# EAGLE design Transmitter V1 (EAGLE 9.6.0)
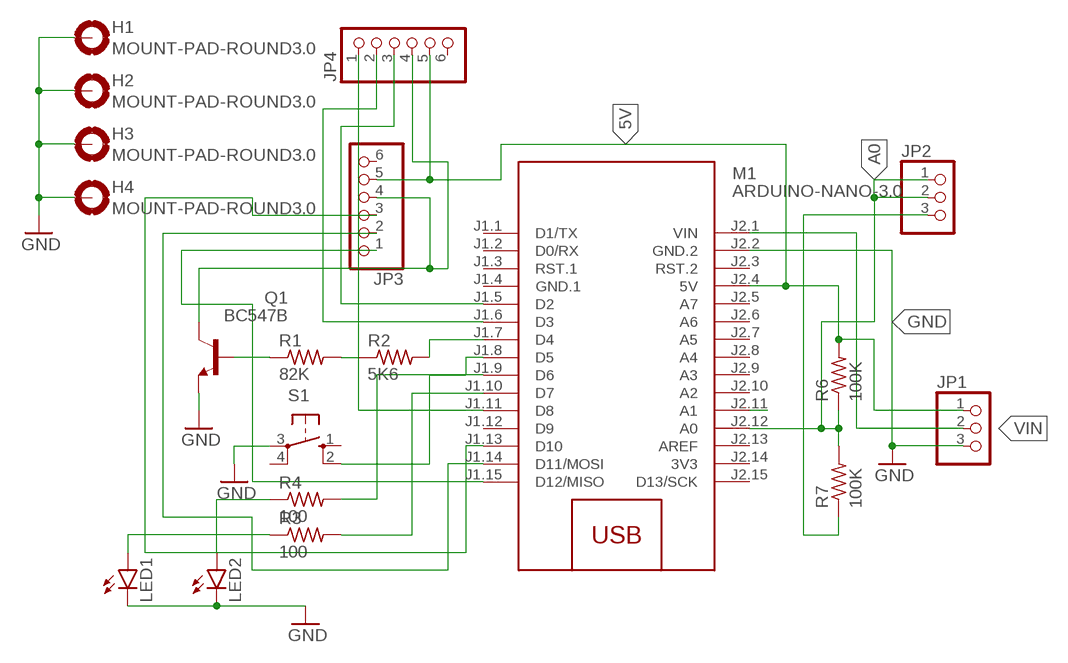
[diagram p0: schematic, sheet 1]

## Parts
H1  MOUNT-PAD-ROUND3.0  [3,0-PAD]
H2  MOUNT-PAD-ROUND3.0  [3,0-PAD]
H3  MOUNT-PAD-ROUND3.0  [3,0-PAD]
H4  MOUNT-PAD-ROUND3.0  [3,0-PAD]
JP1  PINHD-1X3  [1X03]
JP2  PINHD-1X3  [1X03]
JP3  PINHD-1X6  [1X06]
JP4  PINHD-1X6  [1X06]
LED1  LED3MM  [LED3MM]
LED2  LED3MM  [LED3MM]
M1  ARDUINO-NANO-3.0  [ARDUINO-NANO-3.0]
Q1  BC547B  [TO92]
R1  82K  R-US_0207/7  [0207/7]
R2  5K6  R-US_0207/7  [0207/7]
R3  100  R-US_0207/7  [0207/7]
R4  100  R-US_0207/7  [0207/7]
R6  100K  R-US_0207/7  [0207/7]
R7  100K  R-US_0207/7  [0207/7]
S1  10-XX  [B3F-10XX]

## Nets
5V: JP1.1 JP3.5 JP4.5 M1.J2.4(5V) R6.2
A0: JP2.1 JP2.2 M1.J2.12(A0) R6.1 R7.2
GND: H1.B3,0(MOUNT) H2.B3,0(MOUNT) H3.B3,0(MOUNT) H4.B3,0(MOUNT) JP1.3 LED1.K(C) LED2.K(C) M1.J2.2(GND.2) Q1.1(E) S1.3(P)
N$1: M1.J1.7(D4) R2.2
N$2: Q1.2(B) R1.1
N$3: R1.2 R2.1
N$4: JP3.4 JP4.4 Q1.3(C)
N$5: M1.J1.8(D5) S1.2(S1)
N$6: JP3.2 M1.J1.14(D11/MOSI)
N$7: LED2.A R4.1
N$8: LED1.A R3.1
N$9: M1.J1.10(D7) R3.2
N$10: M1.J1.9(D6) R4.2
N$11: JP4.2 M1.J1.6(D3)
N$12: JP2.3 R7.1
N$13: JP4.3 M1.J1.5(D2)
N$14: JP3.3 M1.J1.13(D10)
N$15: JP3.1 M1.J1.15(D12/MISO)
N$18: M1.J2.11(A1)
N$48: JP4.1 M1.J1.11(D8)
VIN: JP1.2 M1.J2.1(VIN)
Unconnected: JP3.6 JP4.6 M1.J1.1(D1/TX) M1.J1.2(D0/RX) M1.J1.3(RST.1) M1.J1.12(D9) M1.J2.3(RST.2) M1.J2.5(A7) M1.J2.6(A6) M1.J2.7(A5) M1.J2.8(A4) M1.J2.9(A3) M1.J2.10(A2) M1.J2.13(AREF) M1.J2.15(D13/SCK) S1.1(S) S1.4(P1)

## Power pins joined to a net without a drawn wire
3V3: M1.J2.14(3V3)
GND.1: M1.J1.4(GND.1)

## Library data of the parts
H1-H4 = holes:MOUNT-PAD-ROUND: MOUNTING PAD, round
JP1 JP2 = pinhead:PINHD-1X3: PIN HEADER
JP3 JP4 = pinhead:PINHD-1X6: PIN HEADER
LED1 LED2 = led:LED: LED OSRAM: - CHIPLED LG R971, LG N971, LY N971, LG Q971, LY Q971, LO R971, LY R971 LH N974, LH R974 LS Q976, LO Q976, LY Q976 LO Q996 - Hyper CHIPLED LW Q18S LB Q993, LB Q99A, LB R99A - SideLED LS A670, LO A670, LY A670, LG A670, LP A670 LB A673, LV A673, LT A673, LW A673 LH A674 LY A675 LS A676, LA A676, LO A676, LY A676, LW A676 LS A679, LY A679, LG A679 - Hyper Micro SIDELED® LS Y876, LA Y876, LO Y876, LY Y876 LT Y87S - SmartLED LW L88C, LW L88S LB L89C, LB L89S, LG L890 LS L89K, LO L89K, LY L89K LS L896, LA L896, LO L896, LY L896 - TOPLED LS T670, LO T670, LY T670, LG T670, LP T670 LSG T670, LSP T670, LSY T670, LOP T670, LYG T670 LG T671, LOG T671, LSG T671 LB T673, LV T673, LT T673, LW T673 LH T674 LS T676, LA T676, LO T676, LY T676, LB T676, LH T676, LSB T676, LW T676 LB T67C, LV T67C, LT T67C, LS T67K, LO T67K, LY T67K, LW E67C LS E67B, LA E67B, LO E67B, LY E67B, LB E67C, LV E67C, LT E67C LW T67C LS T679, LY T679, LG T679 LS T770, LO T770, LY T770, LG T770, LP T770 LB T773, LV T773, LT T773, LW T773 LH T774 LS E675, LA E675, LY E675, LS T675 LS T776, LA T776, LO T776, LY T776, LB T776 LHGB T686 LT T68C, LB T68C - Hyper Mini TOPLED® LB M676 - Mini TOPLED Santana® LG M470 LS M47K, LO M47K, LY M47K Source: http://www.osram.convergy.de LUXEON: - LUMILED® LXK2-PW12-R00, LXK2-PW12-S00, LXK2-PW14-U00, LXK2-PW14-V00 LXK2-PM12-R00, LXK2-PM12-S00, LXK2-PM14-U00 LXK2-PE12-Q00, LXK2-PE12-R00, LXK2-PE12-S00, LXK2-PE14-T00, LXK2-PE14-U00 LXK2-PB12-K00, LXK2-PB12-L00, LXK2-PB12-M00, LXK2-PB14-N00, LXK2-PB14-P00, LXK2-PB14-Q00 LXK2-PR12-L00, LXK2-PR12-M00, LXK2-PR14-Q00, LXK2-PR14-R00 LXK2-PD12-Q00, LXK2-PD12-R00, LXK2-PD12-S00 LXK2-PH12-R00, LXK2-PH12-S00 LXK2-PL12-P00, LXK2-PL12-Q00, LXK2-PL12-R00 Source: www.luxeon.com KINGBRIGHT: KA-3528ASYC Source: www.kingbright.com
M1 = diy-modules:ARDUINO-NANO-3.0: Arduino Nano 3.0 and compatible devices More details available here: https://www.arduino.cc/en/Main/ArduinoBoardNano Click here to find device on ebay.com <http://www.ebay.com/sch/arduino+nano>
Q1 = transistor-npn:BC547*: NPN Transistor
R1-R4 R6 R7 = rcl:R-US_: RESISTOR, American symbol; SPICEPREFIX: R
S1 = switch-omron:10-XX: OMRON SWITCH; MPN: B3F-1000; OC_FARNELL: 176432; OC_NEWARK: 36M3542

## Board
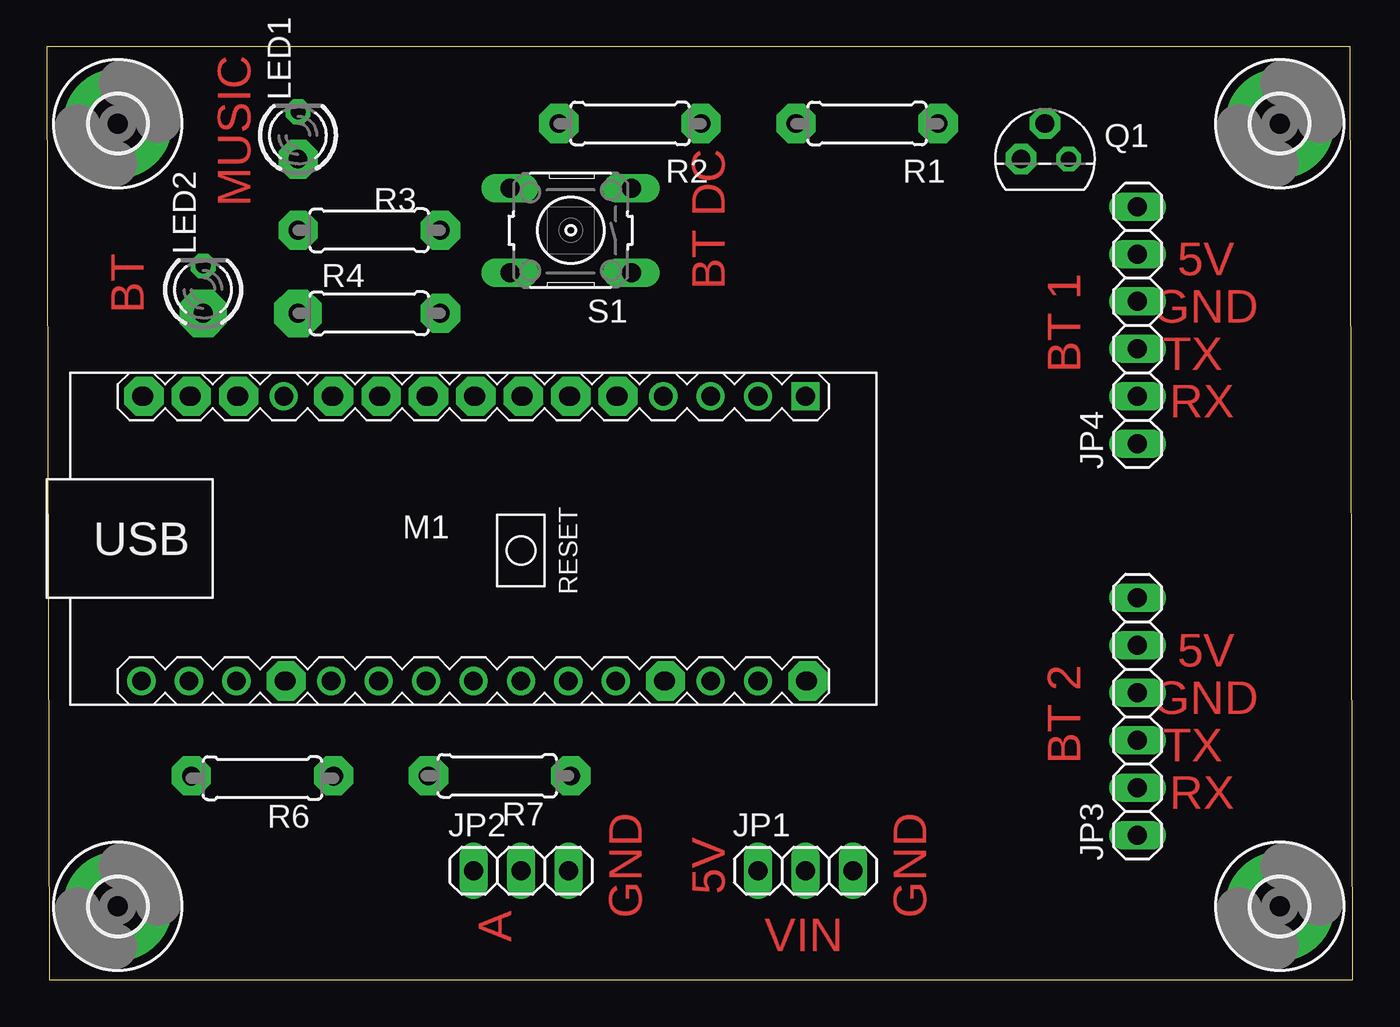
[diagram p1: board, top side]
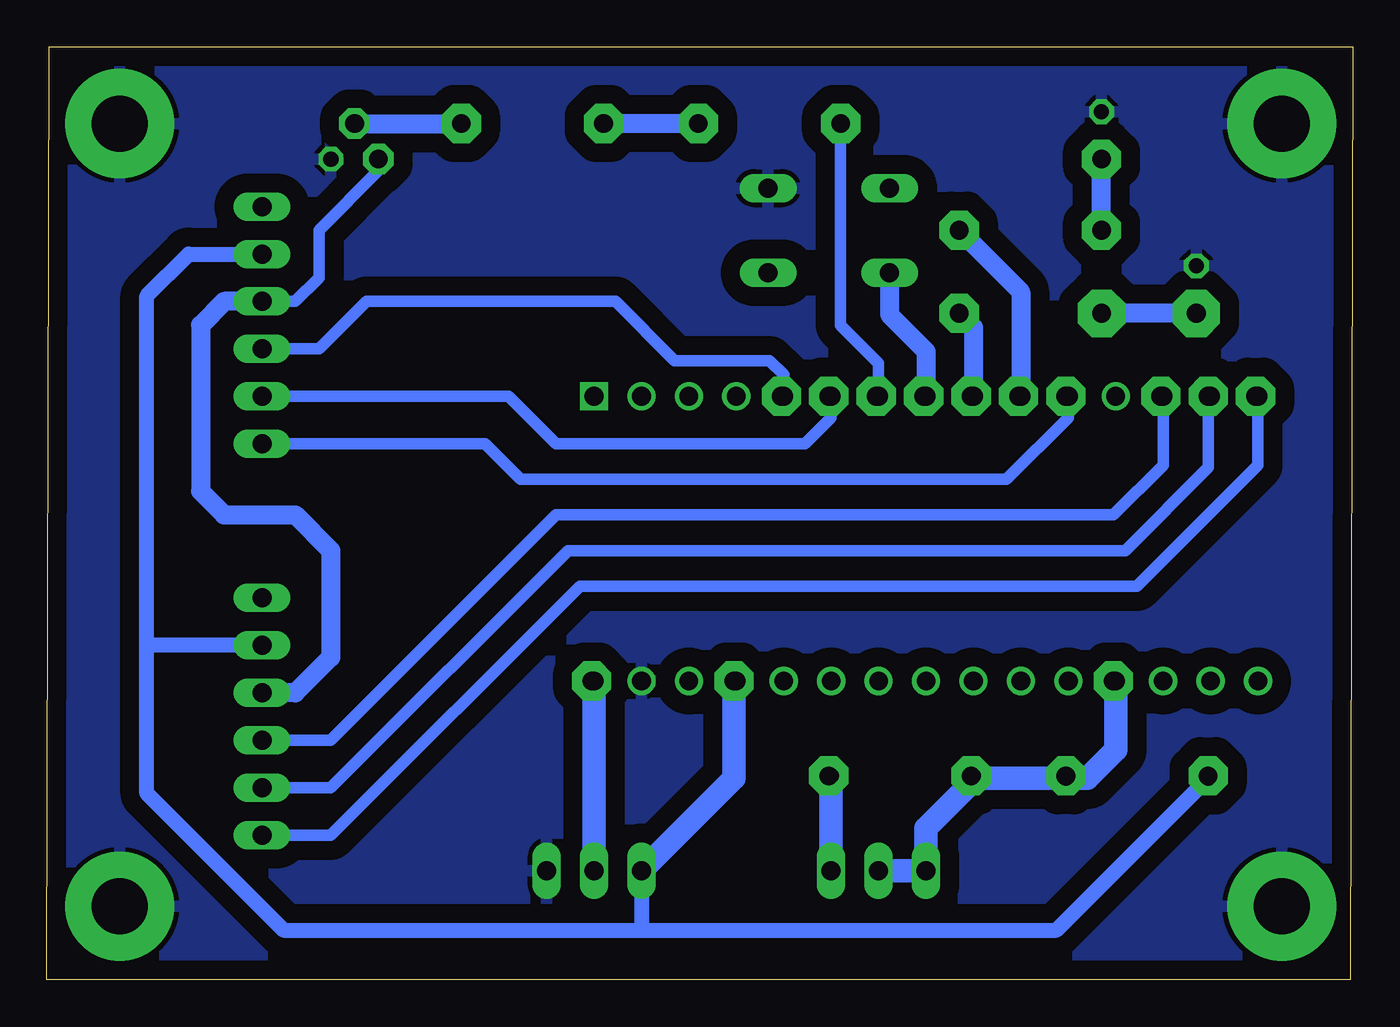
[diagram p2: board, bottom side, seen from below]

Size 69.96 x 49.96 mm. Coordinates in mm from the lower left corner, seen from the top.
Outline: 0.13,0 69.96,0 69.83,49.96 0,49.96 0.13,0
Copper layers (1*16): Top 0.035mm / dielectric 1.5mm / Bottom 0.035mm
Design rules "default": minimum track width 6mil, minimum drill 0.35mm, track to track 6mil, track to pad 6mil, pad to pad 6mil, via to via 6mil, smd to smd 6mil, copper to edge 40mil, drill to drill 6mil, minimum pad ring 10mil, minimum via ring 8mil, stop-mask expansion 4mil, vias tented up to drill 0mil, thermal gap 10mil

### Footprints (pad centres in the part's own frame; a part is rotated, then mirrored left to right if it is on the bottom)
3,0-PAD = drill 3 pad 5.842: B3,0 0,0
1X03 = drill 1.016 long: 1 -2.54,0; 2 0,0; 3 2.54,0
1X06 = drill 1.016 long: 1 -6.35,0; 2 -3.81,0; 3 -1.27,0; 4 1.27,0; 5 3.81,0; 6 6.35,0
LED3MM = drill 0.813 octagon: A -1.27,0; K 1.27,0
ARDUINO-NANO-3.0 = drill 1 square: J1.1 17.78,7.62 | drill 1: J1.2 15.24,7.62; J1.3 12.7,7.62; J1.4 10.16,7.62; J1.5 7.62,7.62; J1.6 5.08,7.62; J1.7 2.54,7.62; J1.8 0,7.62; J1.9 -2.54,7.62; J1.10 -5.08,7.62; J1.11 -7.62,7.62; J1.12 -10.16,7.62; J1.13 -12.7,7.62; J1.14 -15.24,7.62; J1.15 -17.78,7.62; J2.1 17.78,-7.62; J2.2 15.24,-7.62; J2.3 12.7,-7.62; J2.4 10.16,-7.62; J2.5 7.62,-7.62; J2.6 5.08,-7.62; J2.7 2.54,-7.62; J2.8 0,-7.62; J2.9 -2.54,-7.62; J2.10 -5.08,-7.62; J2.11 -7.62,-7.62; J2.12 -10.16,-7.62; J2.13 -12.7,-7.62; J2.14 -15.24,-7.62; J2.15 -17.78,-7.62
TO92 = drill 0.813 octagon: 1 1.27,0; 2 0,1.905; 3 -1.27,0
0207/7 = drill 0.813 octagon: 1 -3.81,0; 2 3.81,0
B3F-10XX = drill 1.016 long: 1 -3.251,2.261; 2 3.251,2.261; 3 -3.251,-2.261; 4 3.251,-2.261

### Placement (x,y rotation side)
H1  3.81,45.85 0 top
H2  66.04,45.85 0 top
H3  66.04,3.94 0 top
H4  3.81,3.94 0 top
JP1  40.64,5.84 0 top
JP2  25.4,5.84 0 top
JP3  58.42,14.1 90 top
JP4  58.42,35.05 90 top
LED1  13.46,45.21 90 top
LED2  8.38,36.96 90 top
M1  22.86,23.62 0 top
Q1  53.47,43.94 0 top
R1  43.94,45.85 180 top
R2  31.24,45.85 180 top
R3  17.27,40.13 0 top
R4  17.27,35.69 0 top
R6  11.56,10.79 180 top
R7  24.13,10.92 180 top
S1  28.07,40.13 180 top

### Tracks (layer width: path | path; a pad name or v marks a point on that pad's centre or on a via)
5V
  Bottom 0.813: 64.59,17.91 64.59,9.98 57.28,2.67 38.23,2.67 | 64.59,17.91 64.59,36.63 62.36,38.86 JP4.5 | JP3.5 64.59,17.91 | R6.2 15.88,2.67 38.23,2.67 | JP1.1 38.1,2.79 38.23,2.67
  Bottom 1.27: JP1.1 33.15,10.79 33.15,15.88 M1.J2.4
A0
  Bottom 1.27: JP2.2 JP2.1 22.86,8.13 20.19,10.79 | 20.19,10.79 R6.1 14.22,10.79 12.7,12.32 M1.J2.12 | 20.19,10.79 R7.2
GND
  pour Bottom (isolate 1.016): 0.13,49.66 69.98,49.66 69.98,0.13 0.13,0.13
N$1
  Bottom 0.61: M1.J1.7 25.4,33.02 27.43,35.05 R2.2
N$2
  Bottom 1.016: Q1.2 R1.1
N$3
  Bottom 1.016: R2.1 R1.2
N$4
  Bottom 0.61: JP4.4 56.64,36.32 55.37,37.59 55.37,40.13 52.2,43.31 Q1.3
  Bottom 1.016: JP4.4 60.45,36.32 61.72,35.05 61.72,26.16 60.45,24.89 56.64,24.89 54.74,22.99 54.74,17.27 56.64,15.37 JP3.4
N$5
  Bottom 1.016: S1.2 24.82,35.61 22.86,33.66 M1.J1.8
N$6
  Bottom 0.61: JP3.2 54.74,10.29 42.04,22.99 12.19,22.99 7.75,27.43 7.75,31.11
  Bottom 0.813: M1.J1.14 7.75,31.11
N$7
  Bottom 1.016: LED2.A R4.1
N$8
  Bottom 1.016: R3.1 LED1.A
N$9
  Bottom 1.016: R3.2 17.78,36.83 M1.J1.10
N$10
  Bottom 1.016: R4.2 20.32,34.93 M1.J1.9
N$11
  Bottom 0.61: JP4.2 45.21,31.24 42.67,28.7 29.34,28.7 27.94,30.1 M1.J1.6
N$12
  Bottom 1.27: JP2.3 R7.1
N$13
  Bottom 0.61: M1.J1.5 30.48,32.39 31.24,33.15 36.32,33.15 39.5,36.32 52.83,36.32 55.37,33.78 JP4.3
N$14
  Bottom 0.61: JP3.3 54.74,12.83 42.67,24.89 12.83,24.89 10.16,27.56 M1.J1.13
N$15
  Bottom 0.61: JP3.1 54.74,7.75 41.4,21.08 11.56,21.08 5.08,27.56 M1.J1.15
N$16  (via drill 1 pad 2.54)
  other vias: 8.38,35.69
N$17  (via drill 1 pad 2.54)
  other vias: 13.46,35.69
N$19  (via drill 1 pad 2.1)
  other vias: 15.37,31.24
N$20  (via drill 1 pad 2.1)
  other vias: 17.91,31.24
N$21  (via drill 1 pad 2.1)
  other vias: 20.45,31.24
N$22  (via drill 1 pad 2.1)
  other vias: 22.99,31.24
N$23  (via drill 1 pad 2.1)
  other vias: 25.53,31.24
N$24  (via drill 1 pad 2.1)
  other vias: 5.21,31.24
N$25  (via drill 1 pad 2.1)
  other vias: 7.75,31.24
N$26  (via drill 1 pad 2.1)
  other vias: 10.29,31.24
N$27  (via drill 1 pad 2.1)
  other vias: 28.07,31.24
N$28  (via drill 1 pad 2.1)
  other vias: 30.61,31.24
N$29  (via drill 1 pad 2.1)
  other vias: 21.08,35.69
N$30  (via drill 1 pad 2.1)
  other vias: 27.43,45.85
N$31  (via drill 1 pad 2.1)
  other vias: 35.05,45.85
N$32  (via drill 1 pad 2.1)
  other vias: 40.13,45.85
N$33  (via drill 1 pad 2.1)
  other vias: 13.46,43.94
N$34  (via drill 1 pad 2.1)
  other vias: 21.08,40.13
N$35  (via drill 1 pad 2.1)
  other vias: 13.46,40.13
N$36  (via drill 1 pad 2.1)
  other vias: 47.75,45.85
N$37  (via drill 1 pad 1.63)
  other vias: 53.47,45.85
N$38  (via drill 1 pad 1.63)
  other vias: 52.2,43.94
N$39  (via drill 1 pad 2.1)
  other vias: 40.77,16
N$40  (via drill 1 pad 2.1)
  other vias: 33.15,16
N$41  (via drill 1 pad 2.1)
  other vias: 28.07,10.92
N$42  (via drill 1 pad 2.1)
  other vias: 20.45,10.92
N$43  (via drill 1 pad 2.1)
  other vias: 15.37,10.92
N$44  (via drill 1 pad 2.1)
  other vias: 7.75,10.92
N$45  (via drill 1 pad 2.1)
  other vias: 12.83,16
N$48
  Bottom 0.61: M1.J1.11 15.24,30.1 18.54,26.8 44.58,26.8 46.48,28.7 JP4.1
VIN
  Bottom 1.27: JP1.2 M1.J2.1

### Text on the board
Top: MUSIC | 5V | BT DC | GND | BT | TX | BT 1 | RX | 5V | GND | TX | BT 2 | RX | 5V | GND | VIN | GND | A